# Altium schematic sheet MIPI_To_HDMI.SchDoc
size A2
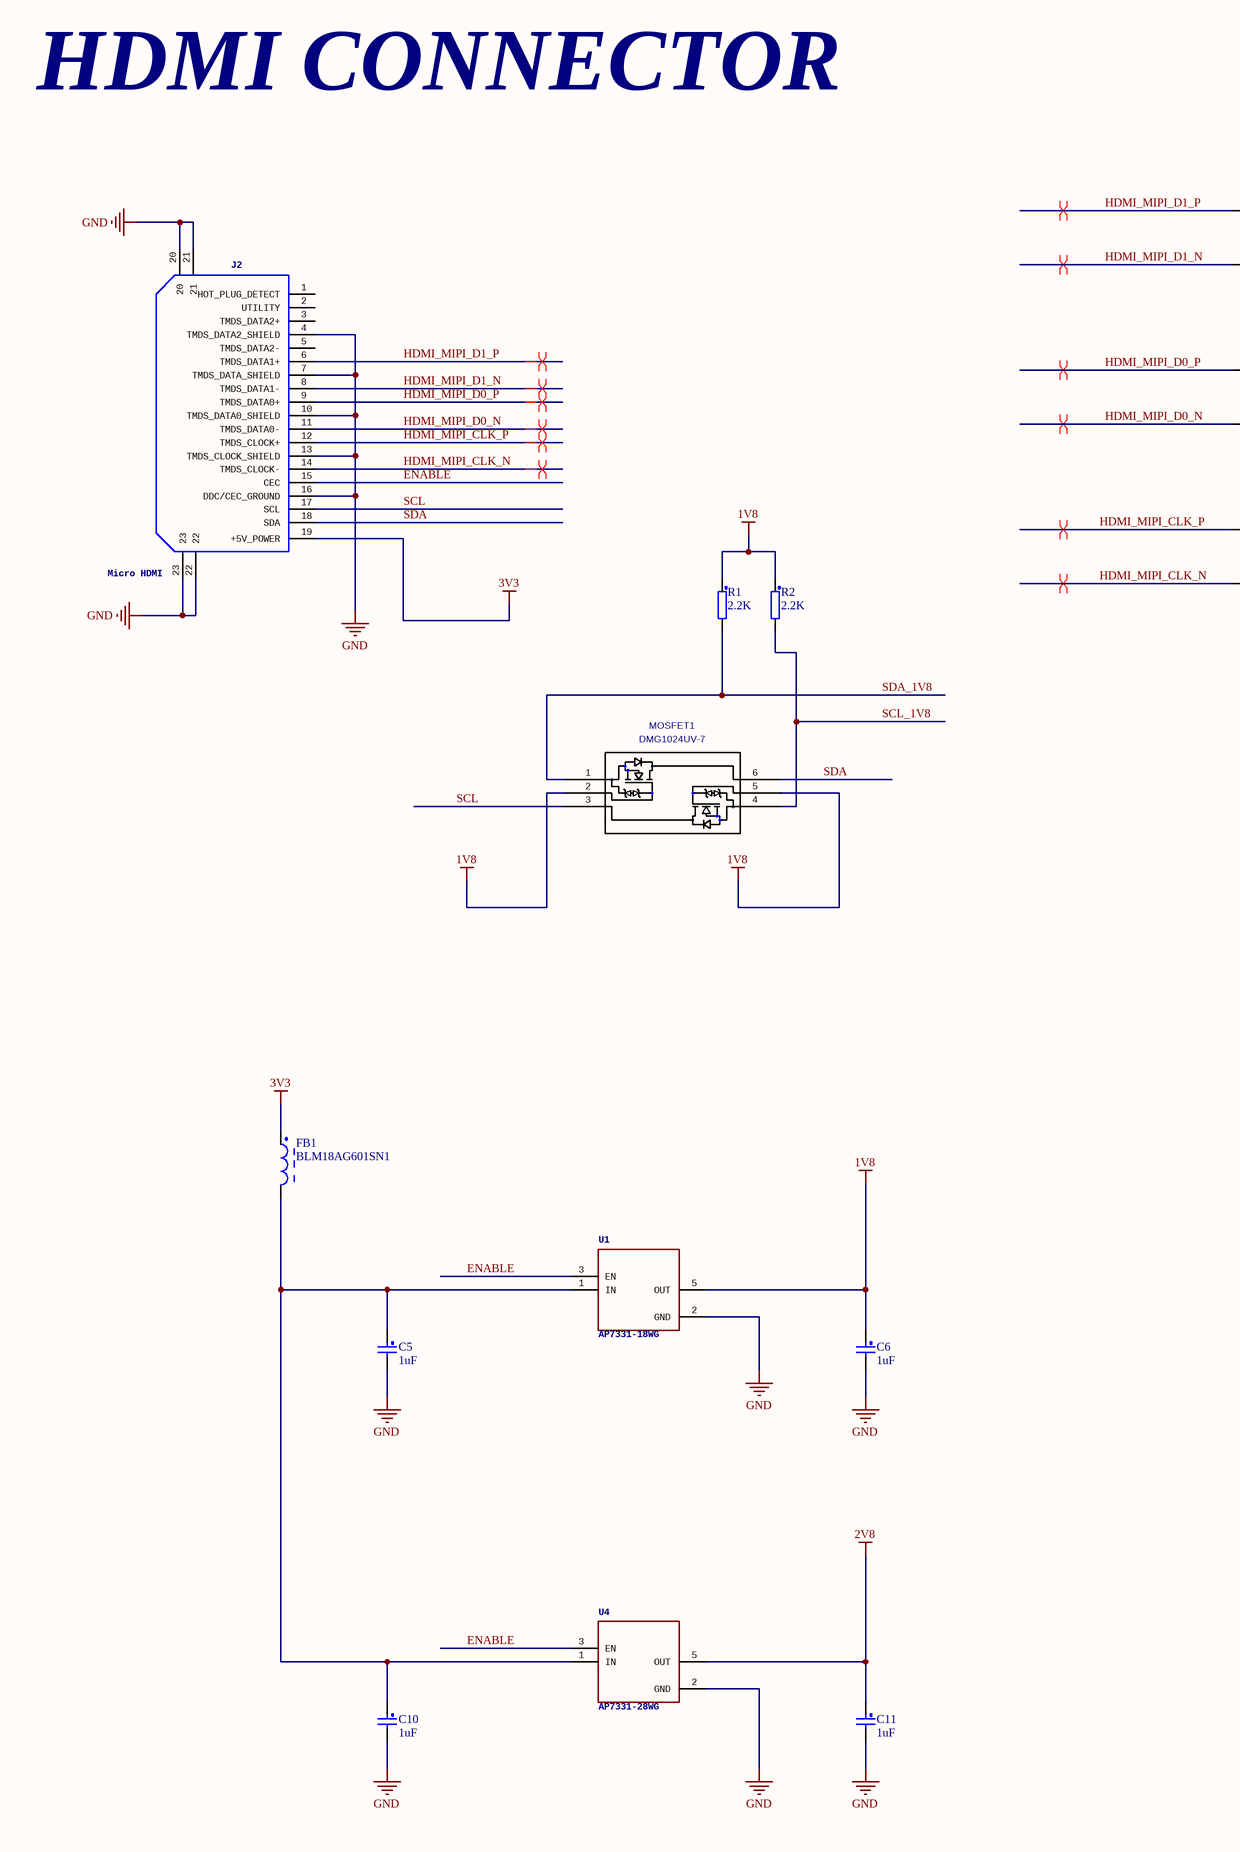
[diagram p0: MIPI_To_HDMI.SchDoc, left]
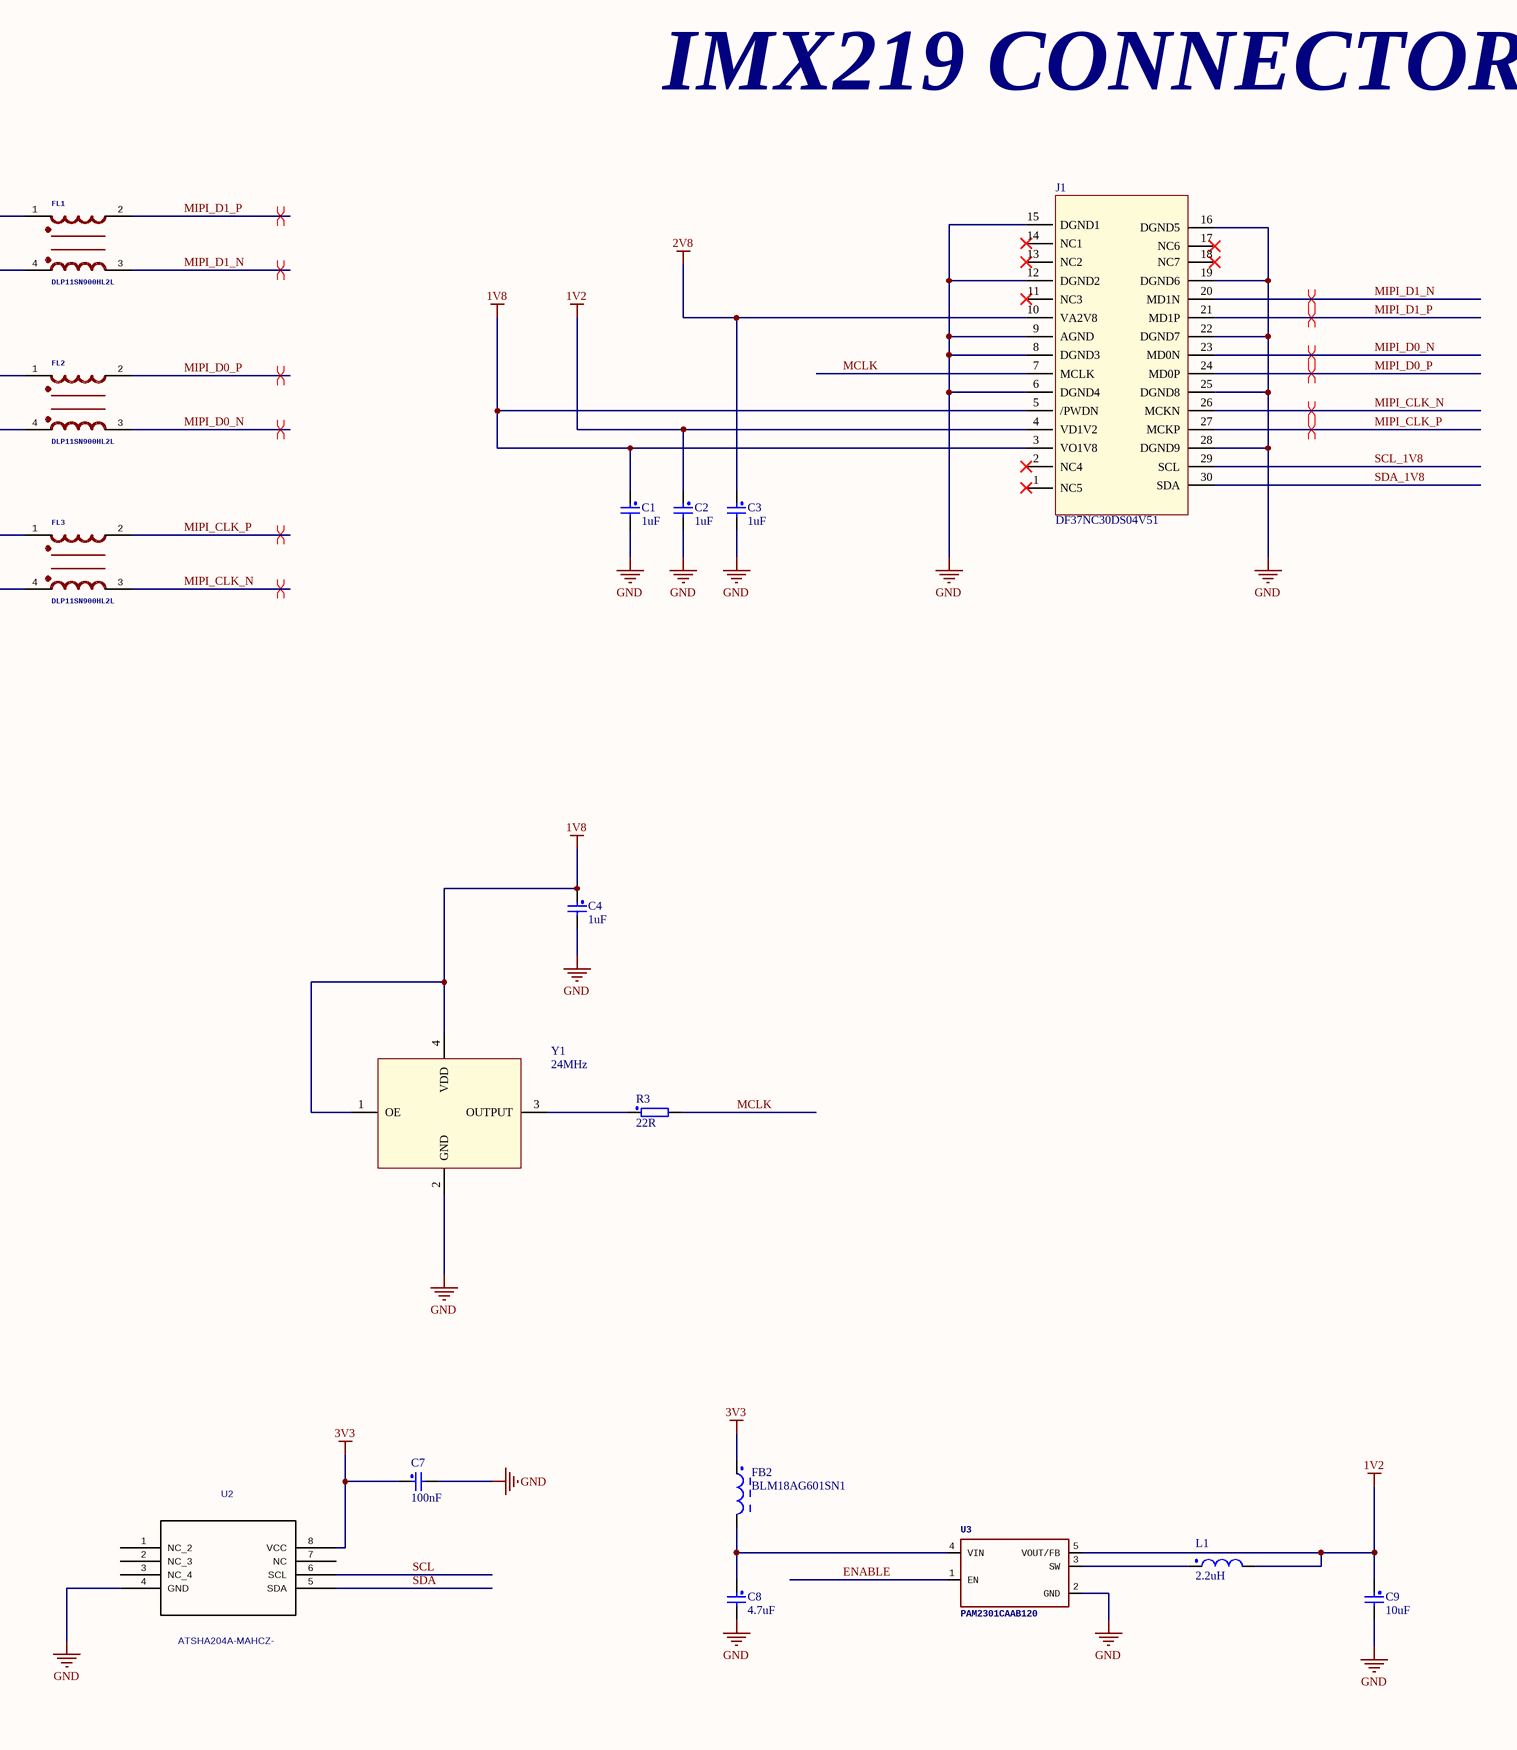
[diagram p1: MIPI_To_HDMI.SchDoc, right]

## Parts
C1  1uF  [CAP-0402]
C2  1uF  [CAP-0402]
C3  1uF  [CAP-0402]
C4  1uF  [CAP-0402]
C5  1uF  [CAP-0402]
C6  1uF  [CAP-0402]
C7  100nF  [CAP-0402]
C8  4.7uF  [CAP-0603]
C9  10uF  [CAP-0805-S]
C10  1uF  [CAP-0402]
C11  1uF  [CAP-0402]
FB1  BLM18AG601SN1  [FBD-0603-S]
FB2  BLM18AG601SN1  [FBD-0603-S]
FL1  DLP11SN900HL2L  [DLP11SN900HL2L]
FL2  DLP11SN900HL2L  [DLP11SN900HL2L]
FL3  DLP11SN900HL2L  [DLP11SN900HL2L]
J1  DF37NC30DS04V51  [DF37NC30DS04V51]
J2  Micro HDMI  [HDMI-0467650301]
L1  2.2uH  [IND-1008]
MOSFET1  DMG1024UV-7  [SOT-563_DIO]
R1  2.2K  [RES-0402]
R2  2.2K  [RES-0402]
R3  22R  [RES-0402]
U1  AP7331-18WG  [AP7331-sot-25]
U2  ATSHA204A-MAHCZ-  [ATSHA204A]
U3  PAM2301CAAB120  [PAM2301CAAB120]
U4  AP7331-28WG  [AP7331-sot-25]
Y1  24MHz  [3225-OSC]

## Nets
1V2: C2.1 C9.1 J1.4(VD1V2) L1.2 U3.5(VOUT/FB)
1V8: C1.1 C4.1 C6.1 J1.3(VO1V8) J1.5(/PWDN) MOSFET1.2(G2) MOSFET1.5(G1) R1.1 R2.1 U1.5(OUT) Y1.1(OE) Y1.4(VDD)
2V8: C3.1 C11.1 J1.10(VA2V8) U4.5(OUT)
3V3: C7.1 FB1.1 FB2.1 J2.19(+5V_POWER) U2.8(VCC)
GND: C1.2 C2.2 C3.2 C4.2 C5.2 C6.2 C7.2 C8.2 C9.2 C10.2 C11.2 J1.6(DGND4) J1.8(DGND3) J1.9(AGND) J1.12(DGND2) J1.15(DGND1) J1.16(DGND5) J1.19(DGND6) J1.22(DGND7) J1.25(DGND8) J1.28(DGND9) J2.4(TMDS_DATA2_SHIELD) J2.7(TMDS_DATA_SHIELD) J2.10(TMDS_DATA0_SHIELD) J2.13(TMDS_CLOCK_SHIELD) J2.16(DDC/CEC_GROUND) J2.20 J2.21 J2.22 J2.23 U1.2(GND) U2.4(GND) U3.2(GND) U4.2(GND) Y1.2(GND)
ENABLE: J2.15(CEC) U1.3(EN) U3.1(EN) U4.3(EN)
HDMI_MIPI_CLK_N: FL3.4 J2.14(TMDS_CLOCK-)
HDMI_MIPI_CLK_P: FL3.1 J2.12(TMDS_CLOCK+)
HDMI_MIPI_D0_N: FL2.4 J2.11(TMDS_DATA0-)
HDMI_MIPI_D0_P: FL2.1 J2.9(TMDS_DATA0+)
HDMI_MIPI_D1_N: FL1.4 J2.8(TMDS_DATA1-)
HDMI_MIPI_D1_P: FL1.1 J2.6(TMDS_DATA1+)
MCLK: J1.7(MCLK) R3.2
MIPI_CLK_N: FL3.3 J1.26(MCKN)
MIPI_CLK_P: FL3.2 J1.27(MCKP)
MIPI_D0_N: FL2.3 J1.23(MD0N)
MIPI_D0_P: FL2.2 J1.24(MD0P)
MIPI_D1_N: FL1.3 J1.20(MD1N)
MIPI_D1_P: FL1.2 J1.21(MD1P)
SCL: J2.17(SCL) MOSFET1.3(D1) U2.6(SCL)
SCL_1V8: J1.29(SCL) MOSFET1.4(S1) R2.2
SDA: J2.18(SDA) MOSFET1.6(D2) U2.5(SDA)
SDA_1V8: J1.30(SDA) MOSFET1.1(S2) R1.2
NetC5_1: C5.1 C10.1 FB1.2 U1.1(IN) U4.1(IN)
NetC8_1: C8.1 FB2.2 U3.4(VIN)
NetL1_1: L1.1 U3.3(SW)
NetR3_1: R3.1 Y1.3(OUTPUT)

Not connected (* = marked no-connect by the designer): J1 1(NC5)* 2(NC4)* 11(NC3)* 13(NC2)* 14(NC1)* 17(NC6)* 18(NC7)*; J2 1(HOT_PLUG_DETECT) 2(UTILITY) 3(TMDS_DATA2+) 5(TMDS_DATA2-); U2 1(NC_2) 2(NC_3) 3(NC_4) 7(NC)

## Layout directives
differential pair: HDMI_MIPI_CLK_N, HDMI_MIPI_CLK_P, HDMI_MIPI_D0_N, HDMI_MIPI_D0_P, HDMI_MIPI_D1_N, HDMI_MIPI_D1_P, MIPI_CLK_N, MIPI_CLK_P, MIPI_D0_N, MIPI_D0_P, MIPI_D1_N, MIPI_D1_P

## Notes on the sheet
- HDMI CONNECTOR
- IMX219 CONNECTOR

## Library data of the parts
C1-C11 = CAP: Capacitor
FB1 FB2 L1 = INDUCTOR
FL1-FL3 = DLP11SN900HL2L: GateName_1: G$1; MF: Murata; SymbolName_1: DLP11SN900HL2L; LibraryName: DLP11SN900HL2L; DeviceSetName: DLP11SN900HL2L; Package: FIL_DLP11SN900HL2L; MP: DLP11SN900HL2L; Package: 1210 Murata; Mouser-Purchase-URL: https://snapeda.com/shop?store=Mouser&id=4300514; Digi-Key_Part_Number: 490-5143-1-ND
J2 = HDMI-0467650301: Manufacturer_Name: Molex; GateName_1: G$1; SymbolName_1: 0467650301; LibraryName: 0467650301; DeviceSetName: 0467650301; Package: 0467650301; Manufacturer_Part_Number: 0467650301; Arrow_Part_Number: 0467650301; Arrow_Price-Stock: https://www.arrow.com/en/products/0467650301/molex; Height: 3mm
MOSFET1 = DMG1024UV-7: C: Copyright (C) 2018 Accelerated Designs. All rights reserved; Vendor: Diodes Inc; Built_By: EMA_Cory; SourceLibrary: Diodes_Inc_2020-03-09; Value: DMG1024UV-7; Datasheet: https://www.diodes.com/assets/Datasheets/ds31974.pdf; Manufacturer_Part_Number: DMG1024UV-7; Copyright: Copyright (C) 2018 Accelerated Designs. All rights reserved
R1-R3 = RES
U1 U4 = AP7331-xxWG-7: GateName_1: G$1; SymbolName_1: AP7331-18WG-7; MF: Diodes Inc.; LibraryName: AP7331-18WG-7; DeviceSetName: AP7331-18WG-7; Package: SOT95P285X145-5N; MP: AP7331-18WG-7; Mouser-Purchase-URL: https://snapeda.com/shop?store=Mouser&id=494406; Package: SOT-753 Diodes Inc.; Digi-Key_Part_Number: AP7331-18WG-7DICT-ND
U2 = ATSHA204A-MAHCZ-: Manufacturer_Part_Number: ATSHA204A-MAHCZ-T; SourceLibrary: Microchip_2019-08-23_25; Built_By: EMA_Molly; Vendor: Microchip; Value: ATSHA204A-MAHCZ-; Copyright: Copyright (C) 2018 Accelerated Designs. All rights reserved
U3 = PAM2301CAAB120: GateName_1: G$1; MF: Diodes Inc.; SymbolName_1: PAM2301CAAB120; LibraryName: PAM2301CAAB120; DeviceSetName: PAM2301CAAB120; Package: SOT95P280X100-5N; Package: SOT-23-5 Diodes Inc.; Digi-Key_Part_Number: PAM2301CAAB120DI-ND; MP: PAM2301CAAB120
Y1 = OSC-3225